# Altium project Sensor de Vacuo 0-10V.PrjPcb
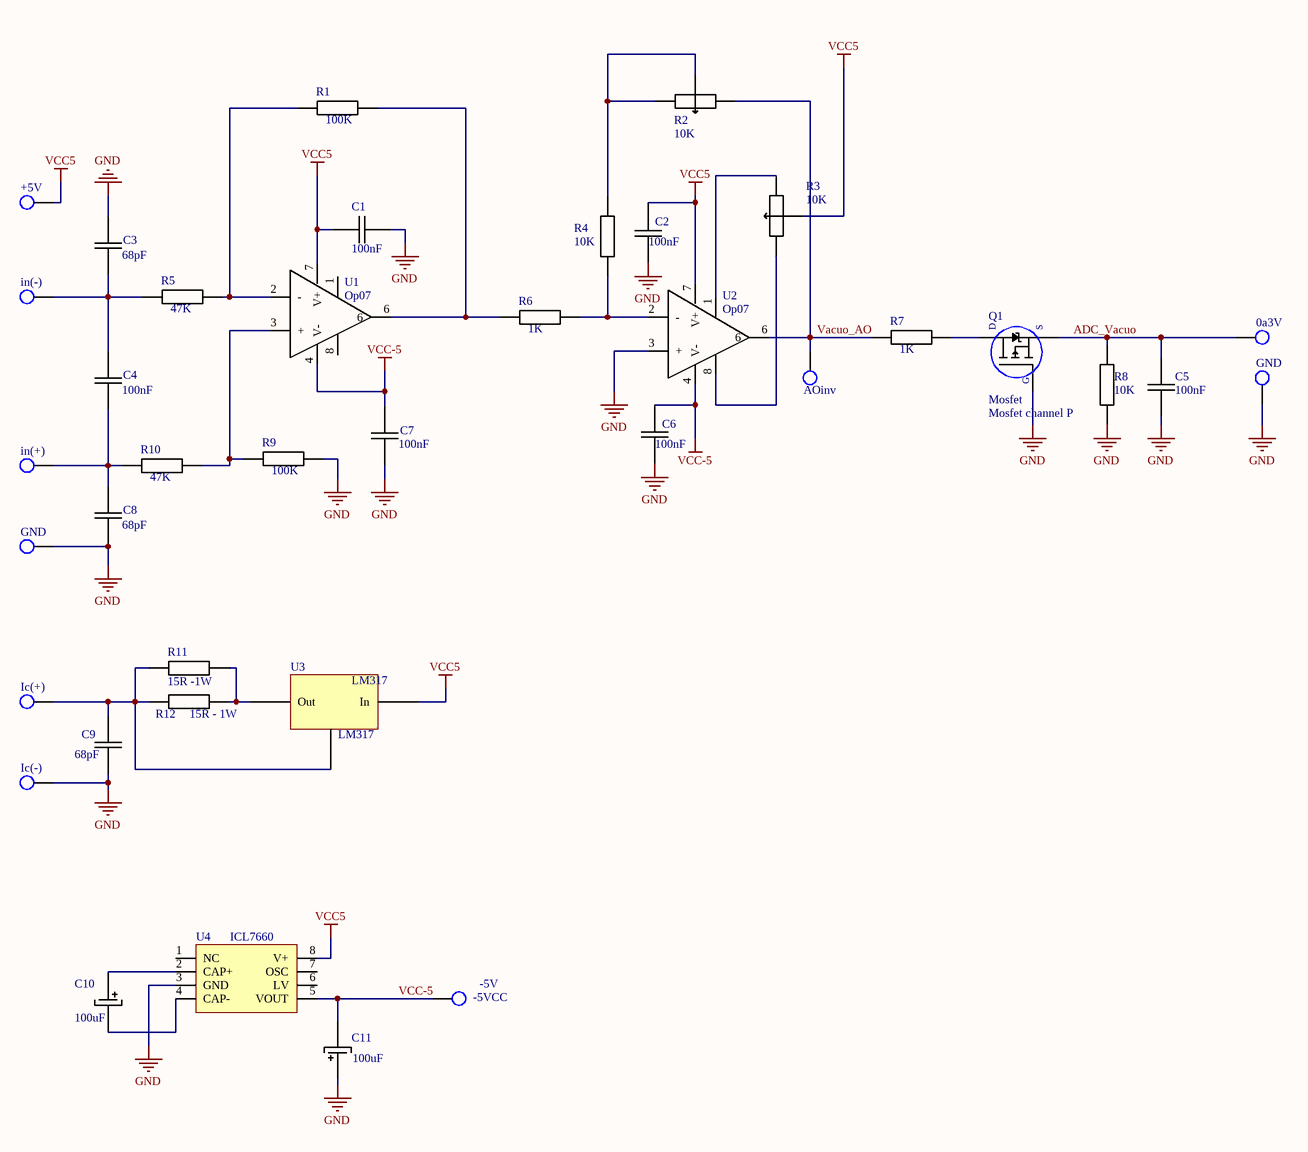
[diagram p0: Sensor de Vacuo 0 -10V.SchDoc]
1 sheet, 38 parts. Net scope: global (net labels, ports and power ports of the same name join across sheets).

## Sheet Sensor de Vacuo 0 -10V.SchDoc
size A3; Organization: Altium Limited; Address1: L3, 12a Rodborough Rd; Address2: Frenchs Forest; Address3: NSW; Address4: Australia 2086

### Parts
(Parts that share a designator on the sheet are numbered #1, #2 ... from top to bottom, then left to right.)
0a3V  VacOut  [Ponto_de_Solda]  (value not drawn)  (no BOM)
+5V  +5V  [Ponto_de_Solda]  (value not drawn)  (no BOM)
-5V  value -5VCC  [Ponto_de_Solda]  (hidden comment: val)  (no BOM)
AOinv  AOinv  [Ponto_de_Solda]  (value not drawn)  (no BOM)
C1  value 100nF  [CAPACITOR CERAMICO]  (hidden comment: val)
C2  value 100nF  [CAPACITOR CERAMICO]  (hidden comment: val)
C3  value 68pF  [CAPACITOR CERAMICO]  (hidden comment: val)
C4  value 100nF  [CAPACITOR CERAMICO]  (hidden comment: val)
C5  value 100nF  [CAPACITOR CERAMICO]  (hidden comment: val)
C6  value 100nF  [CAPACITOR CERAMICO]  (hidden comment: val)
C7  value 100nF  [CAPACITOR CERAMICO]  (hidden comment: val)
C8  value 68pF  [CAPACITOR CERAMICO]  (hidden comment: val)
C9  value 68pF  [CAPACITOR CERAMICO]  (hidden comment: val)
C10  100uF  [Capacitor Radial 10,2 x 17,3]
C11  100uF  [Capacitor Radial 10,2 x 17,3]
GND#1  val  [Ponto_de_Solda]  (value not drawn)  (no BOM)
GND#2  GND  [Ponto_de_Solda]  (value not drawn)  (no BOM)
Ic(+)  Ic(+)  [Ponto_de_Solda]  (value not drawn)  (no BOM)
Ic(-)  Ic(-)  [Ponto_de_Solda]  (value not drawn)  (no BOM)
in(+)  in(+)  [Ponto_de_Solda]  (value not drawn)  (no BOM)
in(-)  in(-)  [Ponto_de_Solda]  (value not drawn)  (no BOM)
Q1  Mosfet  value Mosfet channel P  [TO-220 -  GDS]
R1  value 100K  [Resistor CR25 PTH]  (hidden comment: val)
R2  value 10K  [Trimpot Vertical]  (hidden comment: val)
R3  value 10K  [Trimpot Vertical]  (hidden comment: val)
R4  value 10K  [Resistor CR25 PTH]  (hidden comment: val)
R5  value 47K  [Resistor CR25 PTH]  (hidden comment: val)
R6  value 1K  [Resistor CR25 PTH]  (hidden comment: val)
R7  value 1K  [Resistor CR25 PTH]  (hidden comment: val)
R8  value 10K  [Resistor CR25 PTH]  (hidden comment: val)
R9  value 100K  [Resistor CR25 PTH]  (hidden comment: val)
R10  value 47K  [Resistor CR25 PTH]  (hidden comment: val)
R11  value 15R -1W  [Resistor Vertical 3W]  (hidden comment: val)
R12  value 15R - 1W  [Resistor Vertical 3W]  (hidden comment: val)
U1  value Op07  [DIP-8]  (hidden comment: Value)
U2  value Op07  [DIP-8]  (hidden comment: Value)
U3  value LM317  [TO-220]  (hidden comment: val)
U4  ICL7660  [DIP-8]

### Nets
GND: C1.1 C2.1 C3.2 C5.1 C6.1 C7.1 C8.1 C9.1 C11.1 GND#1.1(S?) GND#2.1(S?) Ic(-).1(S?) Q1.G R8.1 R9.2 U2.3(+) U4.3(GND)
VCC5: +5V.1(S?) C1.2 C2.2 R3.2 U1.7(V+) U2.7(V+) U3.3(In) U4.8(V+)
VCC-5: -5V.1(S?) C6.2 C7.2 C11.2 U1.4(V-) U2.4(V-) U4.5(VOUT)
ADC_Vacuo: 0a3V.1(S?) C5.2 Q1.S R8.2
Vacuo_AO: AOinv.1(S?) R2.1 R7.1 U2.6
NetC3_1: C3.1 C4.2 in(-).1(S?) R5.1
NetC4_1: C4.1 C8.2 in(+).1(S?) R10.1
NetC9_2: C9.2 Ic(+).1(S?) R11.2 R12.1 U3.1(GND)
NetC10_1: C10.1 U4.2(CAP+)
NetC10_2: C10.2 U4.4(CAP-)
NetQ1_D: Q1.D R7.2
NetR1_1: R1.1 R5.2 U1.2(-)
NetR1_2: R1.2 R6.1 U1.6
NetR2_2: R2.2 R2.3 R4.2
NetR3_1: R3.1 U2.8
NetR3_3: R3.3 U2.1
NetR4_1: R4.1 R6.2 U2.2(-)
NetR9_1: R9.1 R10.2 U1.3(+)
NetR11_1: R11.1 R12.2 U3.2(Out)

Not connected (* = marked no-connect by the designer): U1 1 8; U4 1(NC) 6(LV) 7(OSC)

### Notes on the sheet
- Title
- Size:
- Date:
- A3
- Number:
- Time:
- Revision:
- Sheet
- of
- File:

### Library data of the parts
0a3V = Ponto_de_Solda: Value: ADC Vacuo
+5V GND#2 Ic(+) Ic(-) in(+) in(-) = Ponto_de_Solda: Value: Ponto ...
-5V = Ponto_de_Solda
AOinv = Ponto_de_Solda: Value: Vacuo AO
C1-C9 = Capacitor Cerâmico
C10 C11 = Capacitor Eletrolítico
GND#1 = Ponto_de_Solda: Value: GND
Q1 = Mosfet Canal P
R1 R4-R12 = Resistor
R2 R3 = Trimpot
U1 U2 = OP07
U3 = Regulador LM317
U4 = ICL7660: Value: ICL7660